# EAGLE schematic Pahka node basic motherboard (EAGLE 6.3)
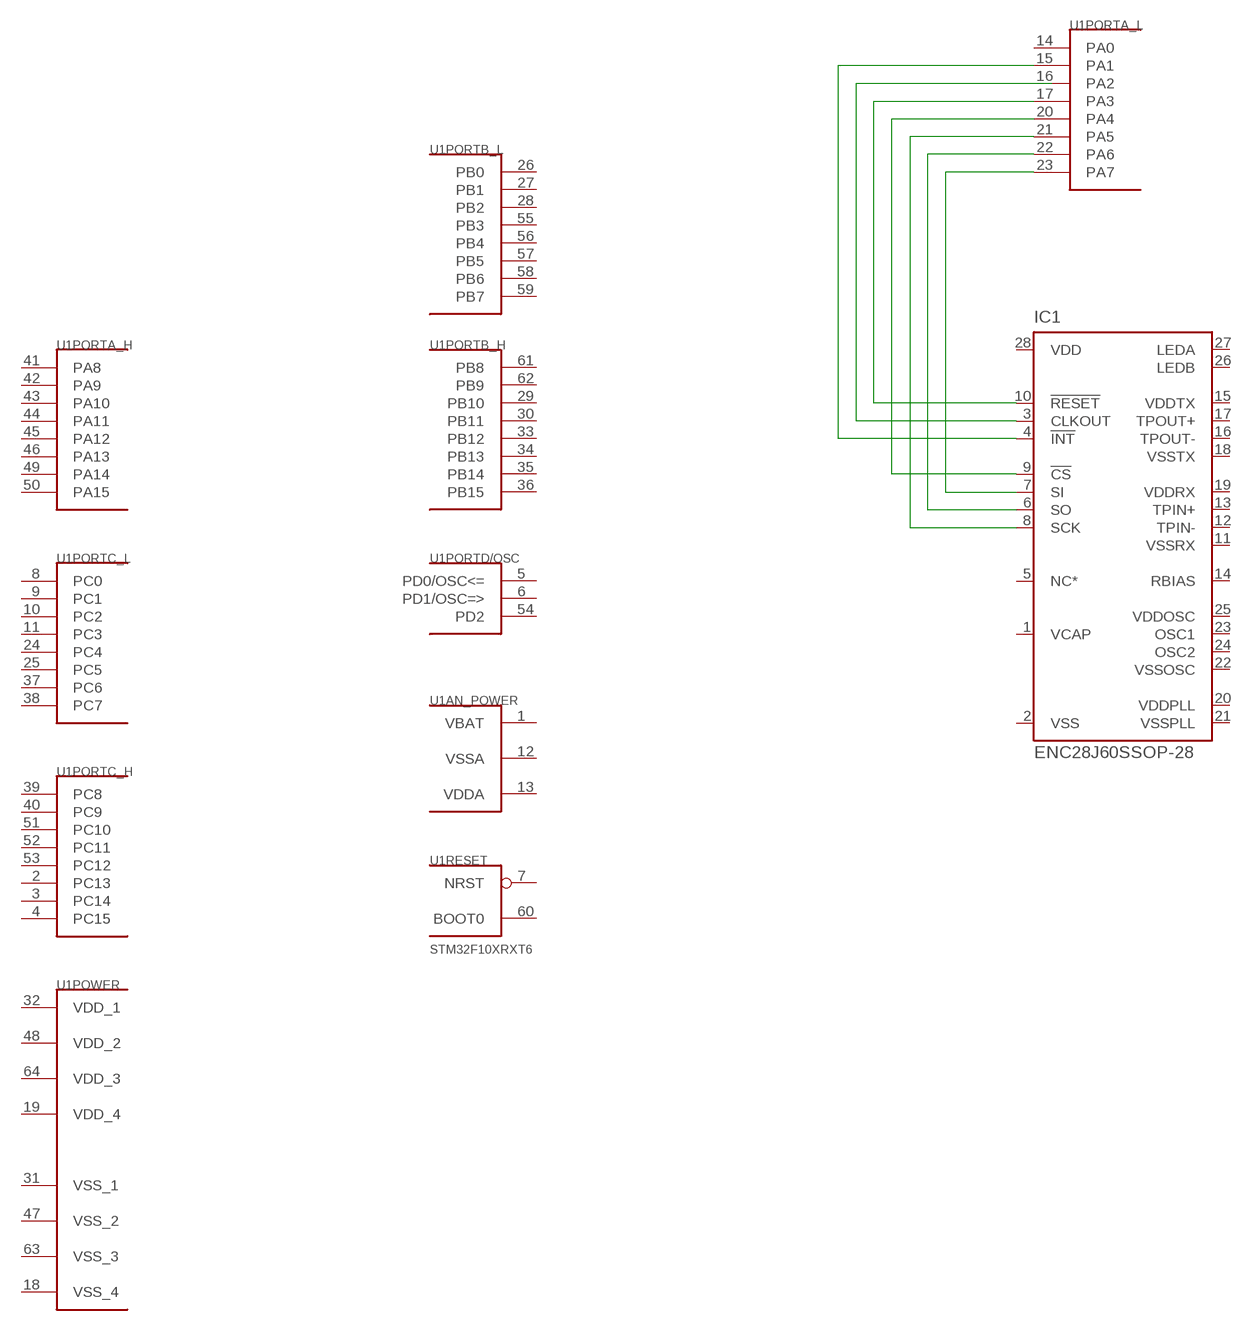
[diagram p0: schematic, sheet 1]

## Parts
IC1  ENC28J60SSOP-28  [SSOP28]
U1  STM32F10XRXT6  [TQFP64]

## Nets
N$1: IC1.3(CLKOUT)
N$2: IC1.4(!INT) U1.15(PORTA_L:PA1)
N$3: IC1.10(!RESET) U1.17(PORTA_L:PA3)
N$4: IC1.9(!CS) U1.20(PORTA_L:PA4)
N$5: IC1.8(SCK) U1.21(PORTA_L:PA5)
N$6: IC1.6(SO) U1.22(PORTA_L:PA6)
N$7: IC1.7(SI) U1.23(PORTA_L:PA7)
Unconnected: IC1.1(VCAP) IC1.2(VSS) IC1.5(NC*) IC1.11(VSSRX) IC1.12(TPIN-) IC1.13(TPIN+) IC1.14(RBIAS) IC1.15(VDDTX) IC1.16(TPOUT-) IC1.17(TPOUT+) IC1.18(VSSTX) IC1.19(VDDRX) IC1.20(VDDPLL) IC1.21(VSSPLL) IC1.22(VSSOSC) IC1.23(OSC1) IC1.24(OSC2) IC1.25(VDDOSC) IC1.26(LEDB) IC1.27(LEDA) IC1.28(VDD) U1.2(PORTC_H:PC13) U1.3(PORTC_H:PC14) U1.4(PORTC_H:PC15) U1.5(PORTD/OSC:PD0/OSC<=) U1.6(PORTD/OSC:PD1/OSC=>) U1.7(RESET:NRST) U1.8(PORTC_L:PC0) U1.9(PORTC_L:PC1) U1.10(PORTC_L:PC2) U1.11(PORTC_L:PC3) U1.14(PORTA_L:PA0) U1.16(PORTA_L:PA2) U1.24(PORTC_L:PC4) U1.25(PORTC_L:PC5) U1.26(PORTB_L:PB0) U1.27(PORTB_L:PB1) U1.28(PORTB_L:PB2) U1.29(PORTB_H:PB10) U1.30(PORTB_H:PB11) U1.33(PORTB_H:PB12) U1.34(PORTB_H:PB13) U1.35(PORTB_H:PB14) U1.36(PORTB_H:PB15) U1.37(PORTC_L:PC6) U1.38(PORTC_L:PC7) U1.39(PORTC_H:PC8) U1.40(PORTC_H:PC9) U1.41(PORTA_H:PA8) U1.42(PORTA_H:PA9) U1.43(PORTA_H:PA10) U1.44(PORTA_H:PA11) U1.45(PORTA_H:PA12) U1.46(PORTA_H:PA13) U1.49(PORTA_H:PA14) U1.50(PORTA_H:PA15) U1.51(PORTC_H:PC10) U1.52(PORTC_H:PC11) U1.53(PORTC_H:PC12) U1.54(PORTD/OSC:PD2) U1.55(PORTB_L:PB3) U1.56(PORTB_L:PB4) U1.57(PORTB_L:PB5) U1.58(PORTB_L:PB6) U1.59(PORTB_L:PB7) U1.60(RESET:BOOT0) U1.61(PORTB_H:PB8) U1.62(PORTB_H:PB9)

## Power pins joined to a net without a drawn wire
VBAT: U1.1(AN_POWER:VBAT)
VDD_1: U1.32(POWER:VDD_1)
VDD_2: U1.48(POWER:VDD_2)
VDD_3: U1.64(POWER:VDD_3)
VDD_4: U1.19(POWER:VDD_4)
VDDA: U1.13(AN_POWER:VDDA)
VSS_1: U1.31(POWER:VSS_1)
VSS_2: U1.47(POWER:VSS_2)
VSS_3: U1.63(POWER:VSS_3)
VSS_4: U1.18(POWER:VSS_4)
VSSA: U1.12(AN_POWER:VSSA)

## Library data of the parts
IC1 = microchip-mod:ENC28J60: Stand-Alone Ethernet Controller with SPI Interface Source: http://ww1.microchip.com/downloads/en/DeviceDoc/39662c.pdf
U1 = stm32:STM32F10XRXT6: STM32F101/103 64pin LQFP